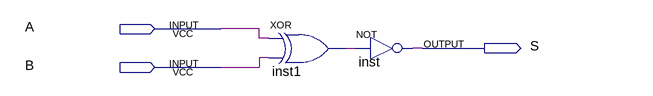
[diagram p0: schematic sheet]
// Quartus schematic Igual.bdf as structural Verilog: 2 symbols, 3 pins
module Igual (
  input  A,
  input  B,
  output S
);

  wire inst1_out;

  xor inst1 (inst1_out, A, B);
  not inst (S, inst1_out);
endmodule
